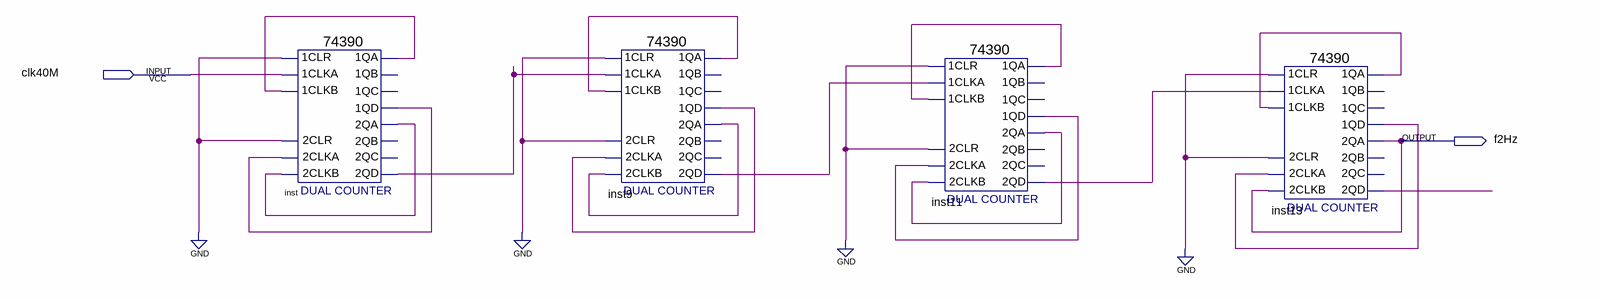
[diagram p0: schematic sheet]
// Quartus schematic DIV20M.bdf as structural Verilog: 4 symbols, 2 pins
module DIV20M (
  input  clk40M,
  output f2Hz
);

  wire inst9_1qa, inst9_1qd, inst9_2qa, inst9_2qd, inst11_1qa, inst11_1qd, inst11_2qa, inst11_2qd,
       inst13_1qa, inst13_1qd, inst13_2qd, inst_1qa, inst_1qd, inst_2qa, inst_2qd;

  \74390  inst (
    .\2CLKA (inst_1qd), .\2CLR (1'b0), .\2CLKB (inst_2qa), .\1CLR (1'b0), .\1CLKA (clk40M),
    .\1CLKB (inst_1qa), .\1QA (inst_1qa), .\1QD (inst_1qd), .\2QA (inst_2qa), .\2QD (inst_2qd));  // open: 1QB, 1QC, 2QB, 2QC
  \74390  inst9 (
    .\2CLKA (inst9_1qd), .\2CLR (1'b0), .\2CLKB (inst9_2qa), .\1CLR (1'b0), .\1CLKA (inst_2qd),
    .\1CLKB (inst9_1qa), .\1QA (inst9_1qa), .\1QD (inst9_1qd), .\2QA (inst9_2qa), .\2QD (inst9_2qd));  // open: 1QB, 1QC, 2QB, 2QC
  \74390  inst11 (
    .\2CLKA (inst11_1qd), .\2CLR (1'b0), .\2CLKB (inst11_2qa), .\1CLR (1'b0), .\1CLKA (inst9_2qd),
    .\1CLKB (inst11_1qa), .\1QA (inst11_1qa), .\1QD (inst11_1qd), .\2QA (inst11_2qa), .\2QD (inst11_2qd));  // open: 1QB, 1QC, 2QB, 2QC
  \74390  inst13 (
    .\2CLKA (inst13_1qd), .\2CLR (1'b0), .\2CLKB (f2Hz), .\1CLR (1'b0), .\1CLKA (inst11_2qd),
    .\1CLKB (inst13_1qa), .\1QA (inst13_1qa), .\1QD (inst13_1qd), .\2QA (f2Hz), .\2QD (inst13_2qd));  // open: 1QB, 1QC, 2QB, 2QC
endmodule
